# EAGLE board CANnode (EAGLE 6.6.0), part 1 of 2
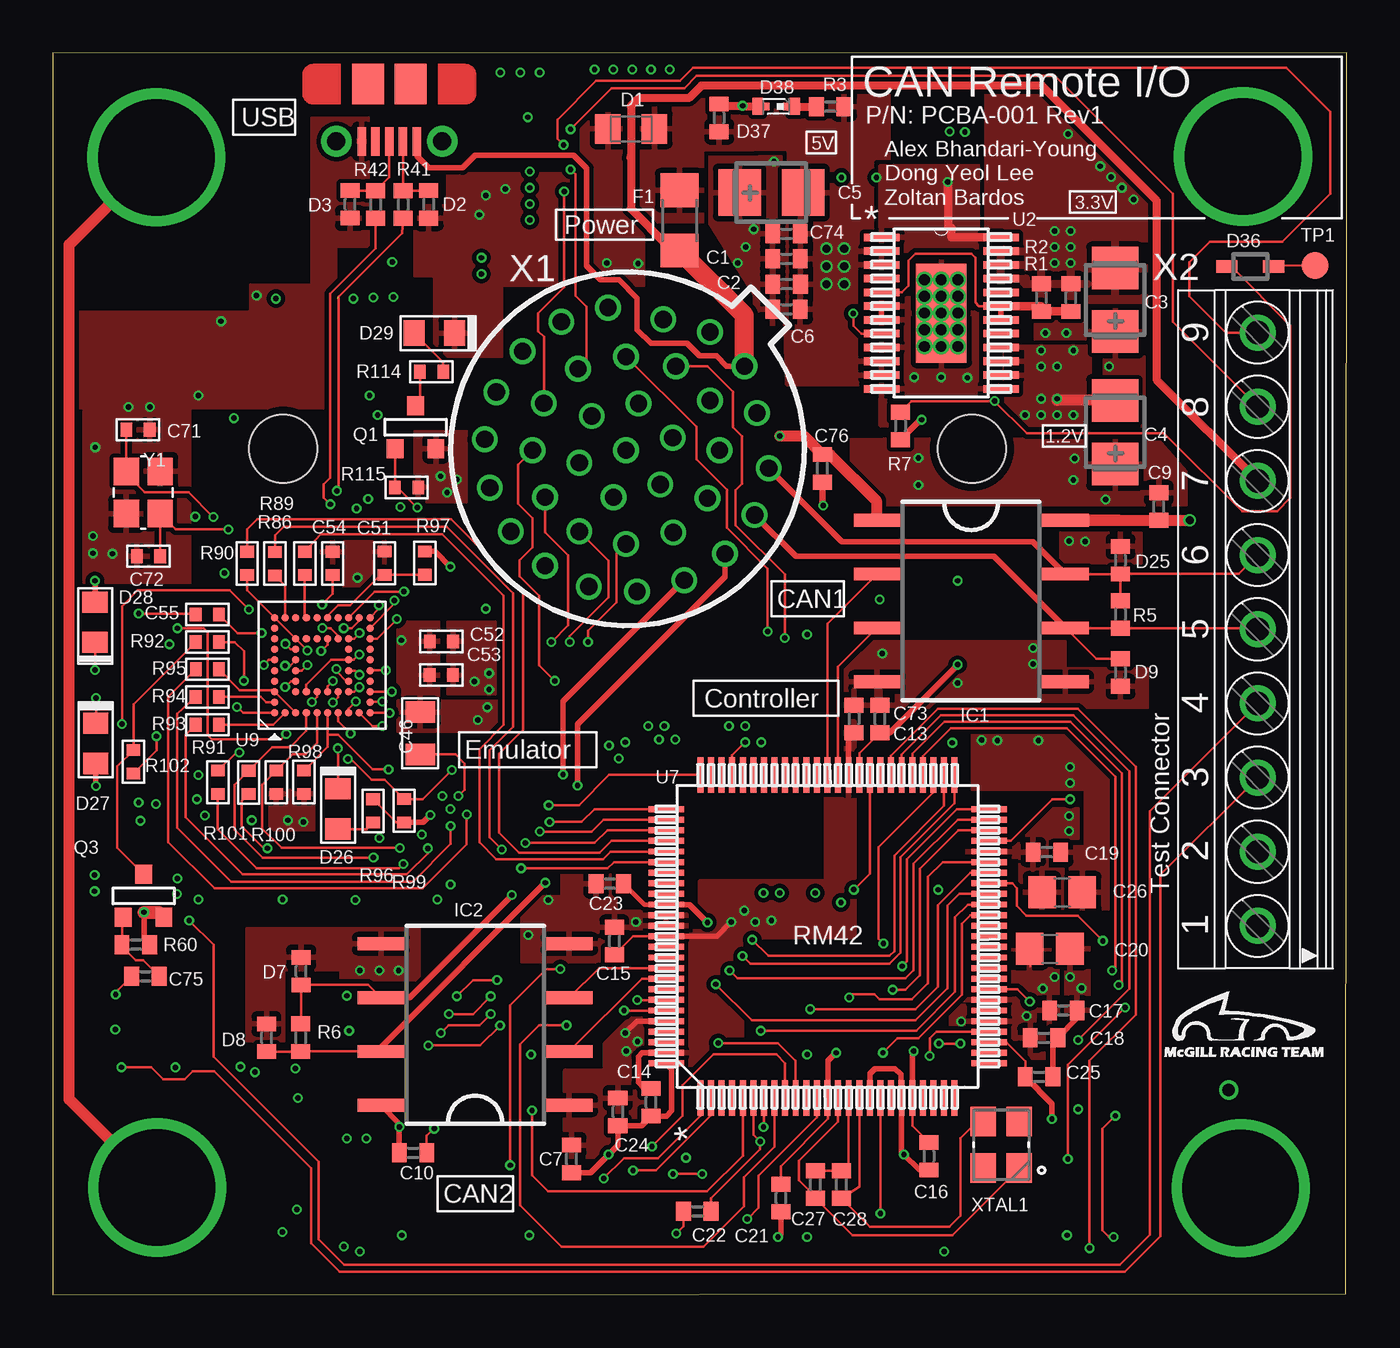
[diagram p3: board, top side]
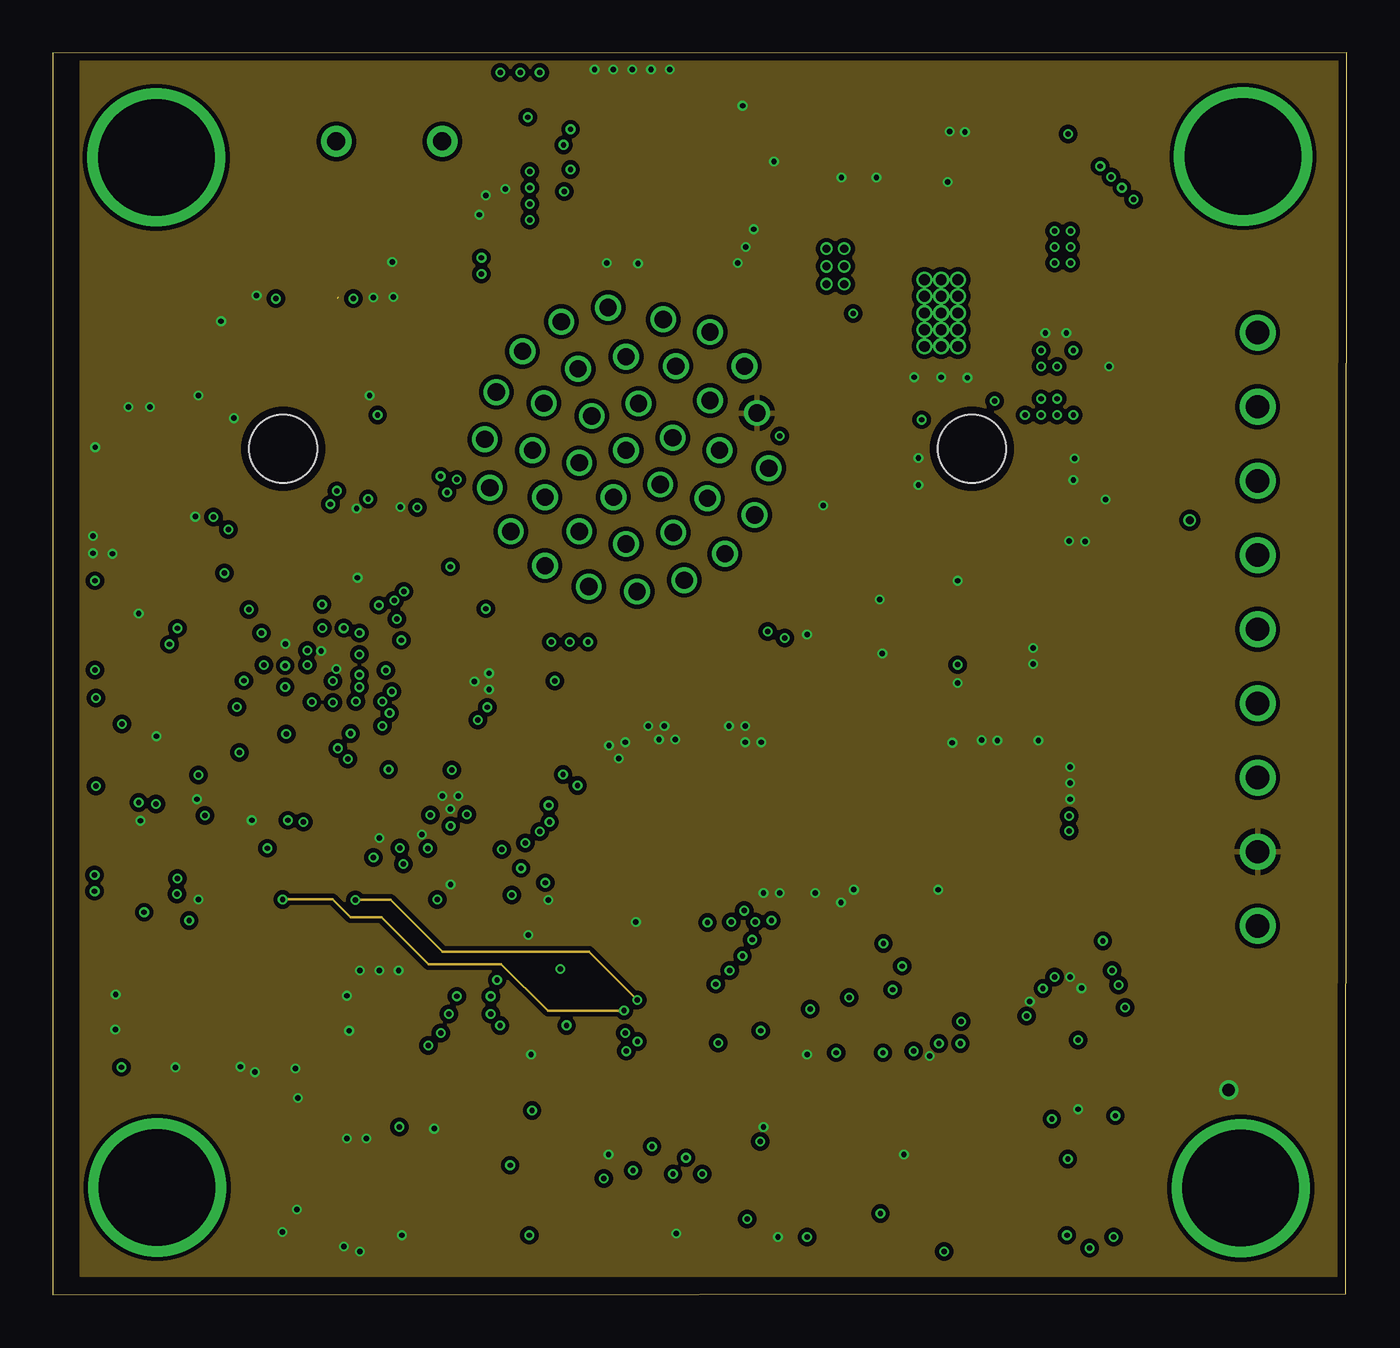
[diagram p4: board, inner layer Route2]
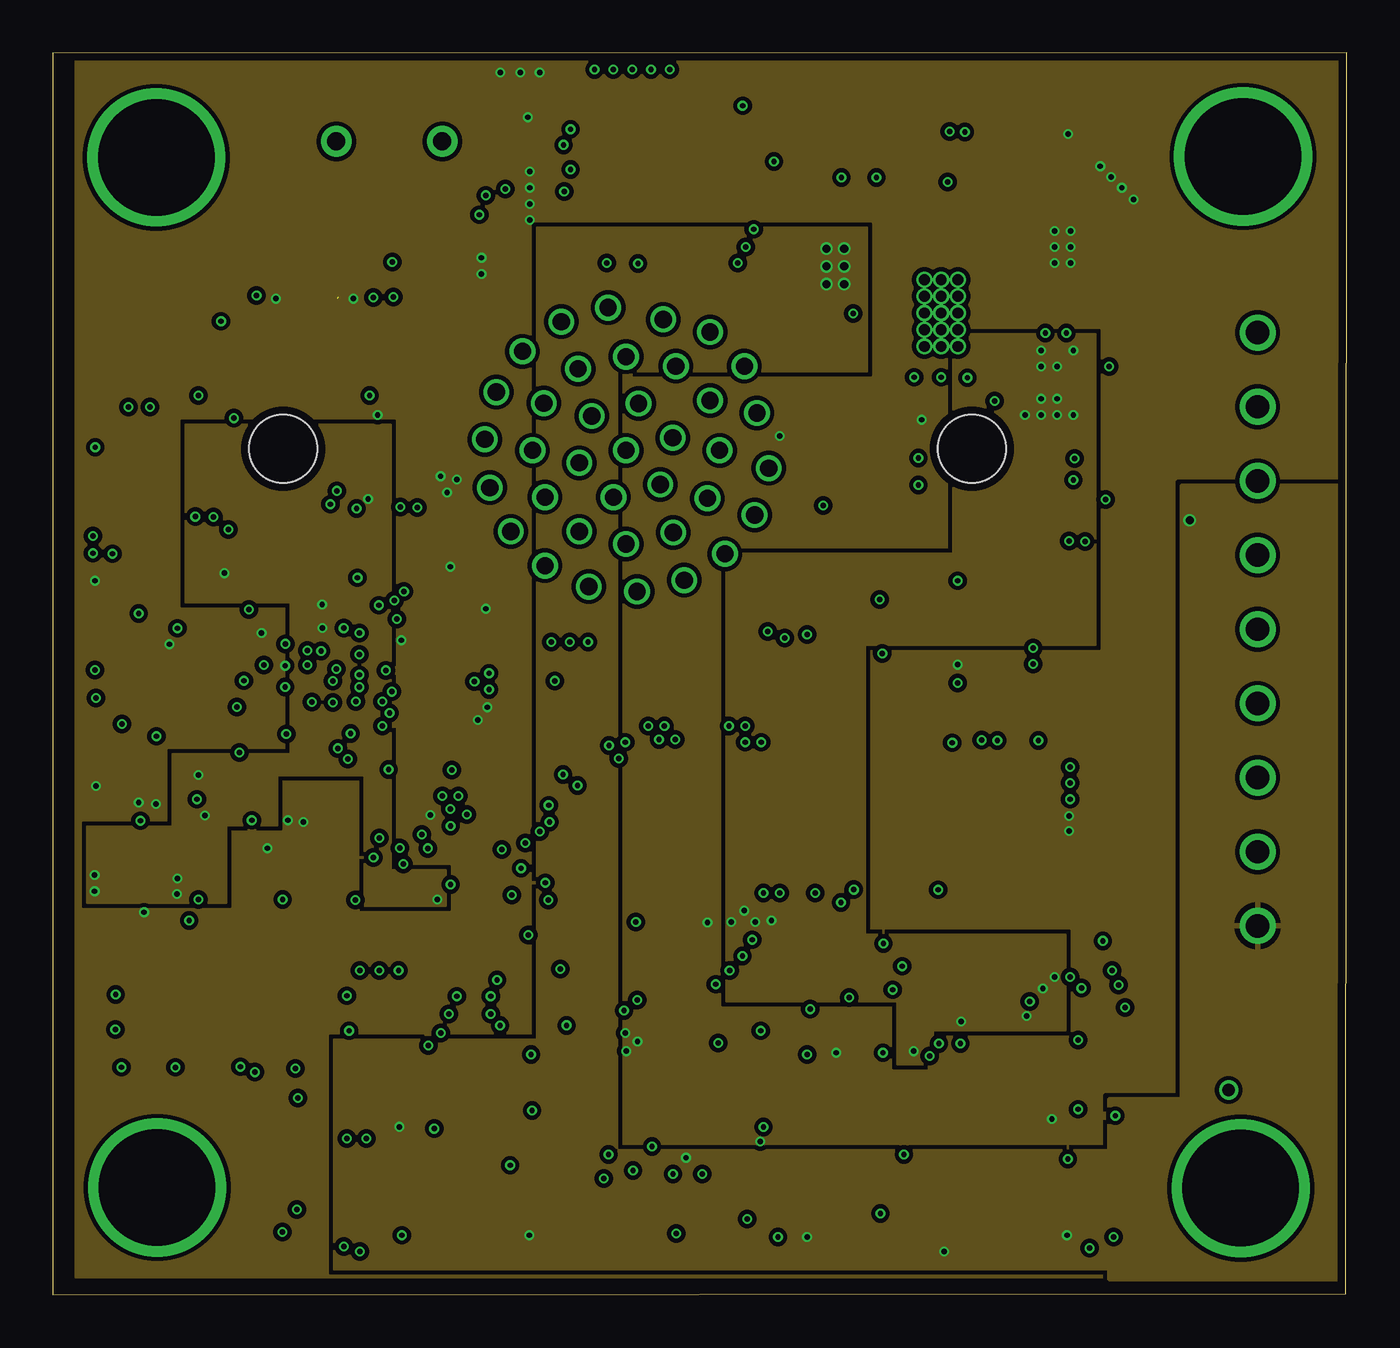
[diagram p5: board, inner layer Route15]
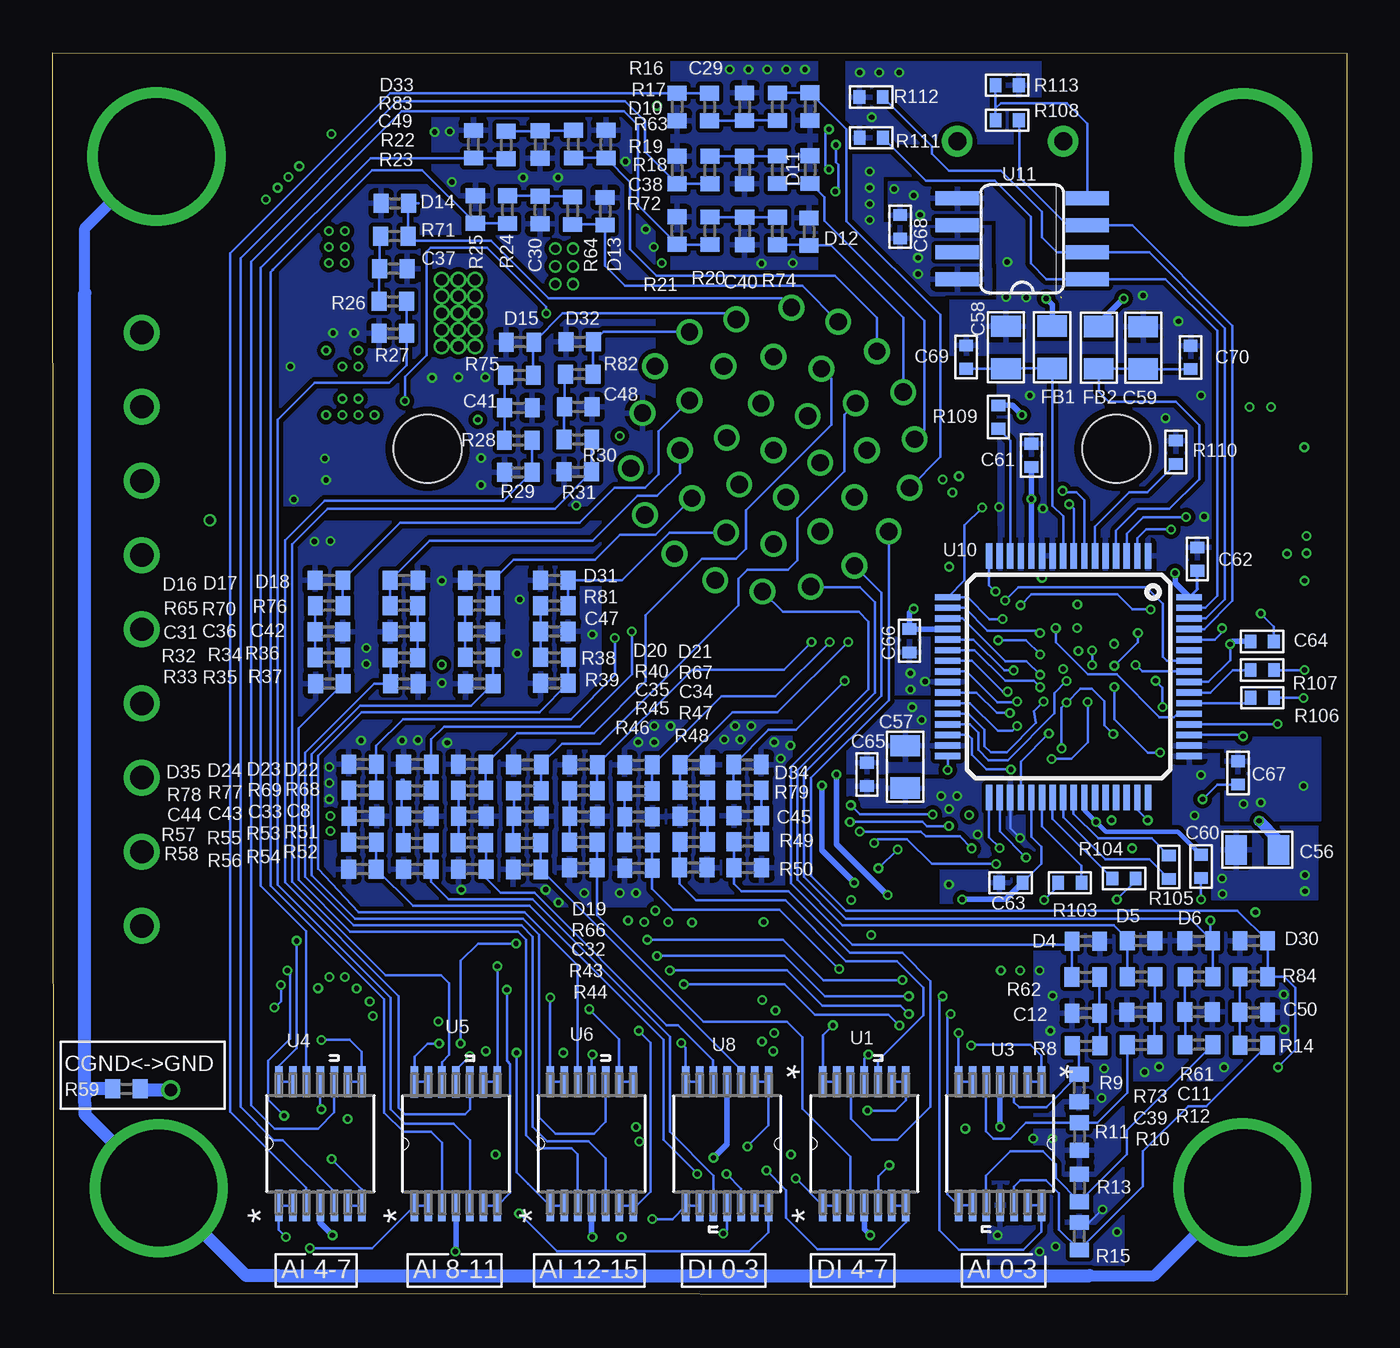
[diagram p6: board, bottom side, seen from below]

Size 61.06 x 58.59 mm. Coordinates in mm from the lower left corner, seen from the top.
Outline: 0,0 61.02,0.04 61.06,58.59 0,58.59 0,0
Copper layers (1*2*15*16): Top 0.035559375mm / dielectric 0.17018125mm / Route2 0.01778125mm / dielectric 47mil / Route15 0.01778125mm / dielectric 0.17018125mm / Bottom 0.035559375mm
Design rules "OSHPark-4layer *": minimum track width 5mil, minimum drill 6mil, track to track 4mil, track to pad 4mil, pad to pad 4mil, via to via 4mil, smd to smd 4mil, copper to edge 15mil, drill to drill 6mil, minimum pad ring 4mil, minimum via ring 4mil, stop-mask expansion 2.5mil, vias tented up to drill 0mil, thermal gap 10mil
Net classes: 0 default: clearance 0.205 mm

## Footprints (pad centres in the part's own frame; a part is rotated, then mirrored left to right if it is on the bottom)
C0402 = smd 0.7 x 0.9: 1 -0.65,0; 2 0.65,0
CT3528 = smd 2 x 2.2: + -1.5,0; - 1.5,0
C0805 = smd 1.3 x 1.5: 1 -0.95,0; 2 0.95,0
0805 = smd 1 x 1.4: 1 -1,0; 2 1,0
0402 = smd 0.55 x 0.65: 1 -0.55,0; 2 0.55,0
CT/CN0805 = smd 1.2 x 1.4: 1 -1.1,0; 2 1.1,0
R0402 = smd 0.7 x 0.9: 1 -0.65,0; 2 0.65,0
LED0805 = smd 1 x 1.2: A 1.052,0.102; C -0.848,0.102
SOD323 = smd 1 x 0.6: 1 -1.1,0; 2 1.1,0
SMARTLED-TTW = smd 0.8 x 0.5: A 0,-0.875; C 0,0.875 | smd 0.35 x 0.35: A@1 0,-0.5; C@1 0,0.5
R1206 = smd 1.6 x 1.803: 1 -1.422,0; 2 1.422,0
DUB-R-PDSO-G8 = smd 0.6 x 2.2: 1 -3.81,-4.445; 2 -1.27,-4.445; 3 1.27,-4.445; 4 3.81,-4.445; 5 3.81,4.445; 6 1.27,4.445; 7 -1.27,4.445; 8 -3.81,4.445
SOT-23 = smd 0.787 x 0.889: 1 0.025,-1.016; 2 -0.94,1.016; 3 0.991,1.016
B1,27 = smd 1.27 x 1.27: TP 0,0
SOP65P640X120-14N = smd 1.473 x 0.356: 1 -2.921,1.956; 2 -2.921,1.295; 3 -2.921,0.66; 4 -2.921,0; 5 -2.921,-0.66; 6 -2.921,-1.295; 7 -2.921,-1.956; 8 2.921,-1.956; 9 2.921,-1.295; 10 2.921,-0.66; 11 2.921,0; 12 2.921,0.66; 13 2.921,1.295; 14 2.921,1.956
PWP24_4P68X2P4 = smd 1.676 x 0.356: 1 -2.819,3.575; 2 -2.819,2.925; 3 -2.819,2.275; 4 -2.819,1.625; 5 -2.819,0.975; 6 -2.819,0.325; 7 -2.819,-0.325; 8 -2.819,-0.975; 9 -2.819,-1.625; 10 -2.819,-2.275; 11 -2.819,-2.925; 12 -2.819,-3.575; 13 2.819,-3.575; 14 2.819,-2.925; 15 2.819,-2.275; 16 2.819,-1.625; 17 2.819,-0.975; 18 2.819,-0.325; 19 2.819,0.325; 20 2.819,0.975; 21 2.819,1.625; 22 2.819,2.275; 23 2.819,2.925; 24 2.819,3.575 | smd 2.388 x 4.674: EPAD 0,0 | drill 0.508: V -0.787,-1.575; V_1 -0.787,-0.787; V_2 -0.787,0; V_3 -0.787,0.787; V_4 -0.787,1.575; V_5 0,-1.575; V_6 0,-0.787; V_7 0,0; V_8 0,0.787; V_9 0,1.575; V_10 0.787,-1.575; V_11 0.787,-0.787; V_12 0.787,0; V_13 0.787,0.787; V_14 0.787,1.575
PZ100 = smd 1.676 x 0.279: 1 -7.62,6; 2 -7.62,5.5; 3 -7.62,5; 4 -7.62,4.5; 5 -7.62,4; 6 -7.62,3.5; 7 -7.62,3; 8 -7.62,2.5; 9 -7.62,2; 10 -7.62,1.5; 11 -7.62,1; 12 -7.62,0.5; 13 -7.62,0; 14 -7.62,-0.5; 15 -7.62,-1; 16 -7.62,-1.5; 17 -7.62,-2; 18 -7.62,-2.5; 19 -7.62,-3; 20 -7.62,-3.5; 21 -7.62,-4; 22 -7.62,-4.5; 23 -7.62,-5; 24 -7.62,-5.5; 25 -7.62,-6; 51 7.62,-6; 52 7.62,-5.5; 53 7.62,-5; 54 7.62,-4.5; 55 7.62,-4; 56 7.62,-3.5; 57 7.62,-3; 58 7.62,-2.5; 59 7.62,-2; 60 7.62,-1.5; 61 7.62,-1; 62 7.62,-0.5; 63 7.62,0; 64 7.62,0.5; 65 7.62,1; 66 7.62,1.5; 67 7.62,2; 68 7.62,2.5; 69 7.62,3; 70 7.62,3.5; 71 7.62,4; 72 7.62,4.5; 73 7.62,5; 74 7.62,5.5; 75 7.62,6 | smd 0.279 x 1.676: 26 -6,-7.62; 27 -5.5,-7.62; 28 -5,-7.62; 29 -4.5,-7.62; 30 -4,-7.62; 31 -3.5,-7.62; 32 -3,-7.62; 33 -2.5,-7.62; 34 -2,-7.62; 35 -1.5,-7.62; 36 -1,-7.62; 37 -0.5,-7.62; 38 0,-7.62; 39 0.5,-7.62; 40 1,-7.62; 41 1.5,-7.62; 42 2,-7.62; 43 2.5,-7.62; 44 3,-7.62; 45 3.5,-7.62; 46 4,-7.62; 47 4.5,-7.62; 48 5,-7.62; 49 5.5,-7.62; 50 6,-7.62; 76 6,7.62; 77 5.5,7.62; 78 5,7.62; 79 4.5,7.62; 80 4,7.62; 81 3.5,7.62; 82 3,7.62; 83 2.5,7.62; 84 2,7.62; 85 1.5,7.62; 86 1,7.62; 87 0.5,7.62; 88 0,7.62; 89 -0.5,7.62; 90 -1,7.62; 91 -1.5,7.62; 92 -2,7.62; 93 -2.5,7.62; 94 -3,7.62; 95 -3.5,7.62; 96 -4,7.62; 97 -4.5,7.62; 98 -5,7.62; 99 -5.5,7.62; 100 -6,7.62
CP56 = smd 0.35 x 0.35: A1 0,0; A2 0.5,0; A3 1,0; A4 1.5,0; A5 2,0; A6 2.5,0; A7 3,0; A8 3.5,0; A9 4,0; A10 4.5,0; B1 0,-0.5; B10 4.5,-0.5; C1 0,-1; C3 1,-1; C4 1.5,-1; C5 2,-1; C6 2.5,-1; C7 3,-1; C8 3.5,-1; C10 4.5,-1; D1 0,-1.5; D3 1,-1.5; D8 3.5,-1.5; D10 4.5,-1.5; E1 0,-2; E3 1,-2; E8 3.5,-2; E10 4.5,-2; F1 0,-2.5; F3 1,-2.5; F8 3.5,-2.5; F10 4.5,-2.5; G1 0,-3; G3 1,-3; G8 3.5,-3; G10 4.5,-3; H1 0,-3.5; H3 1,-3.5; H4 1.5,-3.5; H5 2,-3.5; H6 2.5,-3.5; H7 3,-3.5; H8 3.5,-3.5; H10 4.5,-3.5; J1 0,-4; J10 4.5,-4; K1 0,-4.5; K2 0.5,-4.5; K3 1,-4.5; K4 1.5,-4.5; K5 2,-4.5; K6 2.5,-4.5; K7 3,-4.5; K8 3.5,-4.5; K9 4,-4.5; K10 4.5,-4.5
LQFP64 = smd 1.2 x 0.3: 1 -1.331,8.449; 2 -1.331,7.949; 3 -1.331,7.449; 4 -1.331,6.949; 5 -1.331,6.449; 6 -1.331,5.949; 7 -1.331,5.449; 8 -1.331,4.949; 9 -1.331,4.449; 10 -1.331,3.949; 11 -1.331,3.449; 12 -1.331,2.949; 13 -1.331,2.449; 14 -1.331,1.949; 15 -1.331,1.449; 16 -1.331,0.949; 33 10.069,0.949; 34 10.069,1.449; 35 10.069,1.949; 36 10.069,2.449; 37 10.069,2.949; 38 10.069,3.449; 39 10.069,3.949; 40 10.069,4.449; 41 10.069,4.949; 42 10.069,5.449; 43 10.069,5.949; 44 10.069,6.449; 45 10.069,6.949; 46 10.069,7.449; 47 10.069,7.949; 48 10.069,8.449 | smd 0.3 x 1.2: 17 0.619,-1.001; 18 1.119,-1.001; 19 1.619,-1.001; 20 2.119,-1.001; 21 2.619,-1.001; 22 3.119,-1.001; 23 3.619,-1.001; 24 4.119,-1.001; 25 4.619,-1.001; 26 5.119,-1.001; 27 5.619,-1.001; 28 6.119,-1.001; 29 6.619,-1.001; 30 7.119,-1.001; 31 7.619,-1.001; 32 8.119,-1.001; 49 8.119,10.399; 50 7.619,10.399; 51 7.119,10.399; 52 6.619,10.399; 53 6.119,10.399; 54 5.619,10.399; 55 5.119,10.399; 56 4.619,10.399; 57 4.119,10.399; 58 3.619,10.399; 59 3.119,10.399; 60 2.619,10.399; 61 2.119,10.399; 62 1.619,10.399; 63 1.119,10.399; 64 0.619,10.399
SO8 = smd 0.66 x 2.032: 1 0.635,-5.613; 2 1.905,-5.613; 3 3.175,-5.613; 4 4.445,-5.613; 5 4.445,0.533; 6 3.175,0.533; 7 1.905,0.533; 8 0.635,0.533
USB-MICRO-MOLEX-105017-0001 = smd 0.4 x 1.35: 1 1.2,0; 2 1.85,0; 3 2.5,0; 4 3.15,0; 5 3.8,0 | drill 0.85 pad 1.45: P$1 0,0; P$2 5,0 | smd 1.5 x 1.9: P$3 3.5,-2.7; P$4 1.5,-2.7
AS14-35 = drill 0.813: 1 1.143,6.655; 2 3.124,5.512; 3 5.359,4.064; 4 6.452,2.032; 5 6.756,-0.254; 6 6.274,-2.489; 7 5.08,-4.445; 8 3.302,-5.893; 9 1.143,-6.655; 10 -1.143,-6.655; 11 -3.302,-5.893; 12 -5.08,-4.445; 13 -6.274,-2.489; 14 -6.756,-0.254; 15 -6.452,2.032; 16 -5.359,4.064; 17 -3.124,5.512; 18 -1.143,6.655; 19 1.143,4.369; 20 3.124,3.023; 21 4.318,1.016; 22 4.318,-1.27; 23 3.124,-3.226; 24 1.143,-4.369; 25 -1.143,-4.369; 26 -3.124,-3.226; 27 -4.318,-1.27; 28 -4.318,1.016; 29 -3.124,3.023; 30 -1.143,4.369; 31 1.143,1.88; 32 2.286,-0.102; 33 1.143,-2.083; 34 -1.143,-2.083; 35 -2.286,-0.102; 36 -1.143,1.88; 37 0,-0.102 | hole 3.2: 11.493,11.493; -11.493,-11.493
1751316 = drill 1.1 pad 1.7: 1 -13.973,-0.1; 2 -10.473,-0.1; 3 -6.973,-0.1; 4 -3.473,-0.1; 5 0.028,-0.1; 6 3.527,-0.1; 7 7.027,-0.1; 8 10.527,-0.1; 9 14.027,-0.1
TXC_7M-16.000MAAJ-T = smd 1.4 x 1.2: 1 -1.1,-0.85; 2 1.1,-0.85; 3 1.1,0.85; 4 -1.1,0.85
CRYSTAL_3225 = smd 1.3 x 1.2: P$1 -1,-0.8; P$2 1,-0.8; P$3 1,0.8; P$4 -1,0.8

## Placement (x,y rotation side)
C1  1uF  [C0402]  34.63,48.87 180 top
C2  1uF  [C0402]  34.63,47.68 180 top
C3  22uF  [CT3528]  50.14,46.94 90 top
C4  47uF  [CT3528]  50.14,40.69 90 top
C5  22uF  [CT3528]  33.91,52 0 top
C6  100nF  [C0402]  34.62,46.49 180 top
C7  .1uF  [C0402]  24.48,6.4 270 top
C8  .01uF  [C0402]  38.66,22.56 0 bottom
C9  .1uF  [C0402]  52.2,37.18 90 top
C10  .1uF  [C0402]  17,6.68 0 top
C11  1uF  [C0402]  6.99,13.34 0 bottom
C12  1uF  [C0402]  12.31,13.29 180 bottom
C13  100nF  [C0402]  37.82,27.16 90 top
C14  100nF  [C0402]  28.23,9.07 270 top
C15  100nF  [C0402]  26.51,16.68 90 top
C16  100nF  [C0402]  41.36,6.53 270 top
C17  100nF  [C0402]  47.7,13.41 0 top
C18  100nF  [C0402]  46.78,12.11 0 top
C19  100nF  [C0402]  46.92,20.88 0 top
C20  4.7uF  [C0805]  47.05,16.32 0 top
C21  100nF  [C0402]  34.36,4.56 270 top
C22  100nF  [C0402]  30.42,3.93 180 top
C23  100nF  [C0402]  26.29,19.4 180 top
C24  100nF  [C0402]  26.66,8.62 270 top
C25  100nF  [C0402]  46.54,10.28 0 top
C26  4.7uF  [C0805]  47.64,18.98 0 top
C27  22pF  [C0402]  35.99,5.19 90 top
C28  22pF  [C0402]  37.22,5.19 270 top
C29  1uF  [C0402]  28.42,56.05 90 bottom
C30  1uF  [C0402]  38.07,51.18 270 bottom
C31  1uF  [C0402]  48.04,31.29 0 bottom
C32  .01uF  [C0402]  36.02,22.56 0 bottom
C33  .01uF  [C0402]  41.27,22.57 0 bottom
C34  .01uF  [C0402]  30.81,22.58 180 bottom
C35  .01uF  [C0402]  33.42,22.55 0 bottom
C36  1uF  [C0402]  44.5,31.29 180 bottom
C37  1uF  [C0402]  45,48.41 0 bottom
C38  1uF  [C0402]  28.41,53.07 270 bottom
C39  1uF  [C0402]  9.71,13.33 180 bottom
C40  1uF  [C0402]  28.41,50.19 270 bottom
C41  1uF  [C0402]  39.09,41.85 0 bottom
C42  1uF  [C0402]  40.95,31.29 0 bottom
C43  .01uF  [C0402]  43.86,22.57 0 bottom
C44  .01uF  [C0402]  46.44,22.57 0 bottom
C45  .01uF  [C0402]  28.27,22.59 180 bottom
C46  4.7uF  [0805]  17.34,26.49 270 top
C47  1uF  [C0402]  37.39,31.29 0 bottom
C48  1uF  [C0402]  36.26,41.89 0 bottom
C49  1uF  [C0402]  38.06,54.27 270 bottom
C50  1uF  [C0402]  4.38,13.32 0 bottom
C51  100nF  [0402]  15.66,34.51 90 top
C52  100nF  [0402]  18.34,30.82 0 top
C53  100nF  [0402]  18.33,29.24 0 top
C54  100nF  [0402]  13.2,34.51 90 top
C55  100nF  [0402]  7.28,32.09 180 top
C56  4.7uF  [0805]  4.21,20.98 0 bottom
C57  4.7uF  [0805]  20.83,24.9 270 bottom
C58  4.7uF  [0805]  16.08,44.69 90 bottom
C59  4.7uF  [0805]  9.6,44.68 90 bottom
C60  100nF  [0402]  6.87,20.21 270 bottom
C61  100nF  [0402]  14.87,39.6 90 bottom
C62  100nF  [0402]  7.04,34.71 90 bottom
C63  100nF  [0402]  15.85,19.44 180 bottom
C64  100nF  [0402]  3.98,30.82 0 bottom
C65  100nF  [0402]  22.64,24.55 270 bottom
C66  100nF  [0402]  20.63,30.85 270 bottom
C67  100nF  [0402]  5.13,24.62 270 bottom
C68  100nF  [0402]  21.07,50.39 90 bottom
C69  100nF  [0402]  17.95,44.24 90 bottom
C70  100nF  [0402]  7.36,44.22 90 bottom
C71  22pF  [0402]  4.02,40.81 0 top
C72  22pF  [0402]  4.51,34.84 180 top
C73  100nF  [C0402]  39.03,27.16 90 top
C74  100nF  [C0402]  34.63,50.05 180 top
C75  100nF  [C0402]  4.37,15.01 180 top
C76  .1uF  [C0402]  36.32,38.99 270 top
D1  VARISTORCN0805  [CT/CN0805]  27.3,55.01 180 top
D2  TVS DIODE  [R0402]  17.74,51.45 90 top
D3  TVS DIODE  [R0402]  14.03,51.45 90 top
D4  TVS DIODE  [R0402]  12.31,16.68 180 bottom
D5  TVS DIODE  [R0402]  9.7,16.69 180 bottom
D6  TVS DIODE  [R0402]  6.98,16.69 0 bottom
D7  TVS DIODE  [R0402]  11.72,15.26 270 top
D8  TVS DIODE  [R0402]  10.08,12.12 90 top
D9  TVS DIODE  [R0402]  50.39,29.35 90 top
D10  TVS DIODE  [R0402]  25.33,56.06 90 bottom
D11  TVS DIODE  [R0402]  25.33,53.08 270 bottom
D12  TVS DIODE  [R0402]  25.37,50.15 270 bottom
D13  TVS DIODE  [R0402]  35,51.12 270 bottom
D14  TVS DIODE  [R0402]  44.93,51.49 0 bottom
D15  TVS DIODE  [R0402]  39.01,44.94 0 bottom
D16  TVS DIODE  [R0402]  48.03,33.72 0 bottom
D17  TVS DIODE  [R0402]  44.49,33.72 180 bottom
D18  TVS DIODE  [R0402]  40.95,33.72 0 bottom
D19  TVS DIODE  [R0402]  36.02,25.01 0 bottom
D20  TVS DIODE  [R0402]  33.42,24.99 0 bottom
D21  TVS DIODE  [R0402]  30.81,25 180 bottom
D22  TVS DIODE  [R0402]  38.66,25.01 0 bottom
D23  TVS DIODE  [R0402]  41.28,25.03 0 bottom
D24  TVS DIODE  [R0402]  43.86,25.03 0 bottom
D25  TVS DIODE  [R0402]  50.39,34.65 90 top
D26  Blue  [LED0805]  13.35,23.02 270 top
D27  Blue  [LED0805]  1.92,26.11 270 top
D28  Blue  [LED0805]  2.09,31.62 90 top
D29  Blue  [LED0805]  18.11,45.47 180 top
D30  TVS DIODE  [R0402]  4.38,16.69 0 bottom
D31  TVS DIODE  [R0402]  37.4,33.71 0 bottom
D32  TVS DIODE  [R0402]  36.2,44.96 0 bottom
D33  TVS DIODE  [R0402]  34.96,54.29 270 bottom
D34  TVS DIODE  [R0402]  28.28,25.01 180 bottom
D35  TVS DIODE  [R0402]  46.45,25.04 0 bottom
D36  [SOD323]  56.51,48.52 0 top
D37  TVS DIODE  [R0402]  31.45,55.53 270 top
D38  [SMARTLED-TTW]  34.14,56.07 90 top
F1  0ZCJ0050AF2E  [R1206]  29.58,50.69 90 top
FB1  220R @ 100M  [0805]  13.9,44.7 270 bottom
FB2  220R @ 100M  [0805]  11.7,44.69 270 bottom
IC1  ISO1050DUB  [DUB-R-PDSO-G8]  43.35,32.73 270 top
IC2  ISO1050DUB  [DUB-R-PDSO-G8]  19.93,12.74 90 top
Q1  FDV302P  [SOT-23]  17.14,40.93 180 top
Q3  FDV302P  [SOT-23]  4.31,18.82 180 top
R1  250k  [R0402]  46.66,47.04 90 top
R2  250k  [R0402]  48.04,47.04 90 top
R3  619  [R0402]  36.7,56.06 0 top
R5  120  [R0402]  50.39,32.1 90 top
R6  120  [R0402]  11.69,12.12 270 top
R7  100k  [R0402]  40.01,40.99 270 top
R8  20.1K  [R0402]  12.29,11.74 0 bottom
R9  39K  [R0402]  12.63,9.75 90 bottom
R10  20.1k  [R0402]  9.7,11.79 0 bottom
R11  39K  [R0402]  12.6,7.46 90 bottom
R12  20.1k  [R0402]  6.97,11.8 180 bottom
R13  39K  [R0402]  12.6,5.03 270 bottom
R14  20.1k  [R0402]  4.38,11.77 180 bottom
R15  39K  [R0402]  12.61,2.75 270 bottom
R16  20.1k  [R0402]  30.06,56.04 270 bottom
R17  39K  [R0402]  31.6,56.04 90 bottom
R18  20.1k  [R0402]  30.06,53.06 90 bottom
R19  39K  [R0402]  31.6,53.06 270 bottom
R20  20.1k  [R0402]  30.06,50.2 90 bottom
R21  39K  [R0402]  31.61,50.21 270 bottom
R22  20.1k  [R0402]  39.67,54.25 90 bottom
R23  39K  [R0402]  41.21,54.28 270 bottom
R24  20.1k  [R0402]  39.61,51.2 90 bottom
R25  39K  [R0402]  41.13,51.2 270 bottom
R26  20.1k  [R0402]  45.02,46.87 180 bottom
R27  39K  [R0402]  45.02,45.36 0 bottom
R28  20.1k  [R0402]  39.1,40.31 180 bottom
R29  39K  [R0402]  39.1,38.8 0 bottom
R30  20.1k  [R0402]  36.28,40.35 180 bottom
R31  39K  [R0402]  36.28,38.82 0 bottom
R32  20.1k  [R0402]  48.04,30.06 180 bottom
R33  39K  [R0402]  48.02,28.83 0 bottom
R34  20.1k  [R0402]  44.5,30.06 0 bottom
R35  39K  [R0402]  44.48,28.83 180 bottom
R36  20.1k  [R0402]  40.95,30.06 180 bottom
R37  39K  [R0402]  40.94,28.83 0 bottom
R38  20.1k  [R0402]  37.39,30.07 180 bottom
R39  39K  [R0402]  37.39,28.85 0 bottom
R40  1k  [R0402]  33.43,23.76 0 bottom
R41  22  [R0402]  16.53,51.44 270 top
R42  22  [R0402]  15.24,51.44 270 top
R43  20.1k  [R0402]  36.03,21.35 180 bottom
R44  39K  [R0402]  36.03,20.14 0 bottom
R45  20.1k  [R0402]  33.43,21.33 180 bottom
R46  39K  [R0402]  33.42,20.12 0 bottom
R47  20.1k  [R0402]  30.82,21.36 0 bottom
R48  39K  [R0402]  30.84,20.15 180 bottom
R49  20.1k  [R0402]  28.27,21.37 0 bottom
R50  39K  [R0402]  28.26,20.14 180 bottom
R51  20.1k  [R0402]  38.69,21.31 180 bottom
R52  39K  [R0402]  38.69,20.06 0 bottom
R53  20.1k  [R0402]  41.29,21.32 180 bottom
R54  39K  [R0402]  41.28,20.08 0 bottom
R55  20.1k  [R0402]  43.87,21.32 180 bottom
R56  39K  [R0402]  43.86,20.07 0 bottom
R57  20.1k  [R0402]  46.45,21.34 180 bottom
R58  39K  [R0402]  46.45,20.07 0 bottom
R59  DNP  [R0402]  57.59,9.7 180 bottom
R60  39K  [R0402]  3.91,16.51 0 top
R61  698  [R0402]  6.96,15.01 0 bottom
R62  698  [R0402]  12.31,14.99 180 bottom
R63  698  [R0402]  26.87,56.05 90 bottom
R64  698  [R0402]  36.54,51.15 270 bottom
R65  698  [R0402]  48.03,32.51 0 bottom
R66  1k  [R0402]  36.02,23.78 0 bottom
R67  1k  [R0402]  30.82,23.79 180 bottom
R68  1k  [R0402]  38.67,23.78 0 bottom
R69  1k  [R0402]  41.28,23.79 0 bottom
R70  698  [R0402]  44.49,32.51 180 bottom
R71  698  [R0402]  44.95,49.95 0 bottom
R72  698  [R0402]  26.86,53.08 270 bottom
R73  698  [R0402]  9.69,15.01 180 bottom
R74  698  [R0402]  26.87,50.18 270 bottom
R75  698  [R0402]  39.04,43.39 0 bottom
R76  698  [R0402]  40.95,32.51 0 bottom
R77  1k  [R0402]  43.86,23.79 0 bottom
R78  1k  [R0402]  46.45,23.79 0 bottom
R79  1k  [R0402]  28.28,23.8 180 bottom
R81  698  [R0402]  37.39,32.51 0 bottom
R82  698  [R0402]  36.22,43.43 0 bottom
R83  698  [R0402]  36.5,54.29 270 bottom
R84  698  [R0402]  4.38,15 0 bottom
R86  0R  [0402]  11.89,34.5 90 top
R89  0R  [0402]  10.48,34.49 270 top
R90  0R  [0402]  9.17,34.5 270 top
R91  0R  [0402]  7.79,24.18 90 top
R92  0R  [0402]  7.28,30.79 0 top
R93  0R  [0402]  7.29,26.89 0 top
R94  0R  [0402]  7.28,28.2 0 top
R95  0R  [0402]  7.29,29.5 0 top
R96  200  [0402]  15.11,22.82 270 top
R97  10K  [0402]  17.56,34.52 90 top
R98  1K  [0402]  11.85,24.18 90 top
R99  1K  [0402]  16.57,22.83 90 top
R100  1K  [0402]  10.55,24.18 90 top
R101  1K  [0402]  9.24,24.17 90 top
R102  10K  [0402]  3.8,25.14 90 top
R103  0R  [0402]  13.06,19.43 180 bottom
R104  0R  [0402]  10.51,19.64 0 bottom
R105  0R  [0402]  8.38,20.17 270 bottom
R106  200R  [0402]  3.98,28.16 0 bottom
R107  200R  [0402]  3.98,29.47 0 bottom
R108  2.2K  [0402]  16.02,55.42 0 bottom
R109  4.7K  [0402]  16.44,41.41 270 bottom
R110  12K  [0402]  8.06,39.75 270 bottom
R111  4.7K  [0402]  22.43,54.59 180 bottom
R112  4.7K  [0402]  22.44,56.51 180 bottom
R113  4.7K  [0402]  16.02,57.07 0 bottom
R114  120R  [0402]  17.87,43.55 180 top
R115  100K  [0402]  16.69,38.09 0 top
TP1  TPSB1,27  [B1,27]  59.57,48.55 270 top
U1  LM324PW  [SOP65P640X120-14N]  22.76,7.12 90 bottom
U2  TPS70445_PWP_24  [PWP24_4P68X2P4]  41.93,46.32 0 top
U3  LM324PW  [SOP65P640X120-14N]  16.36,7.13 270 bottom
U4  LM324PW  [SOP65P640X120-14N]  48.44,7.12 90 bottom
U5  LM324PW  [SOP65P640X120-14N]  42.04,7.11 90 bottom
U6  LM324PW  [SOP65P640X120-14N]  35.63,7.12 90 bottom
U7  RM42L432_PZ_100RM42L432_PZ_100  [PZ100]  36.56,16.91 90 top
U8  LM324PW  [SOP65P640X120-14N]  29.24,7.12 270 bottom
U9  XC2C32A-6CP56C  [CP56]  10.46,27.45 90 top
U10  FT2232HL  [LQFP64]  17.82,33.53 270 bottom
U11  93LC56C-I/SN  [SO8]  17.85,47.28 90 bottom
U$5  USB-CON-5PIN-105017-0001  [USB-MICRO-MOLEX-105017-0001]  18.38,54.42 180 top
X1  AS14-35  [AS14-35]  27.12,39.91 315 top
X2  1751316  [1751316]  56.77,31.37 90 top
XTAL1  7M-16.000MAAJ-T  [TXC_7M-16.000MAAJ-T]  44.77,7.07 90 top
Y1  12M  [CRYSTAL_3225]  4.26,37.85 270 top